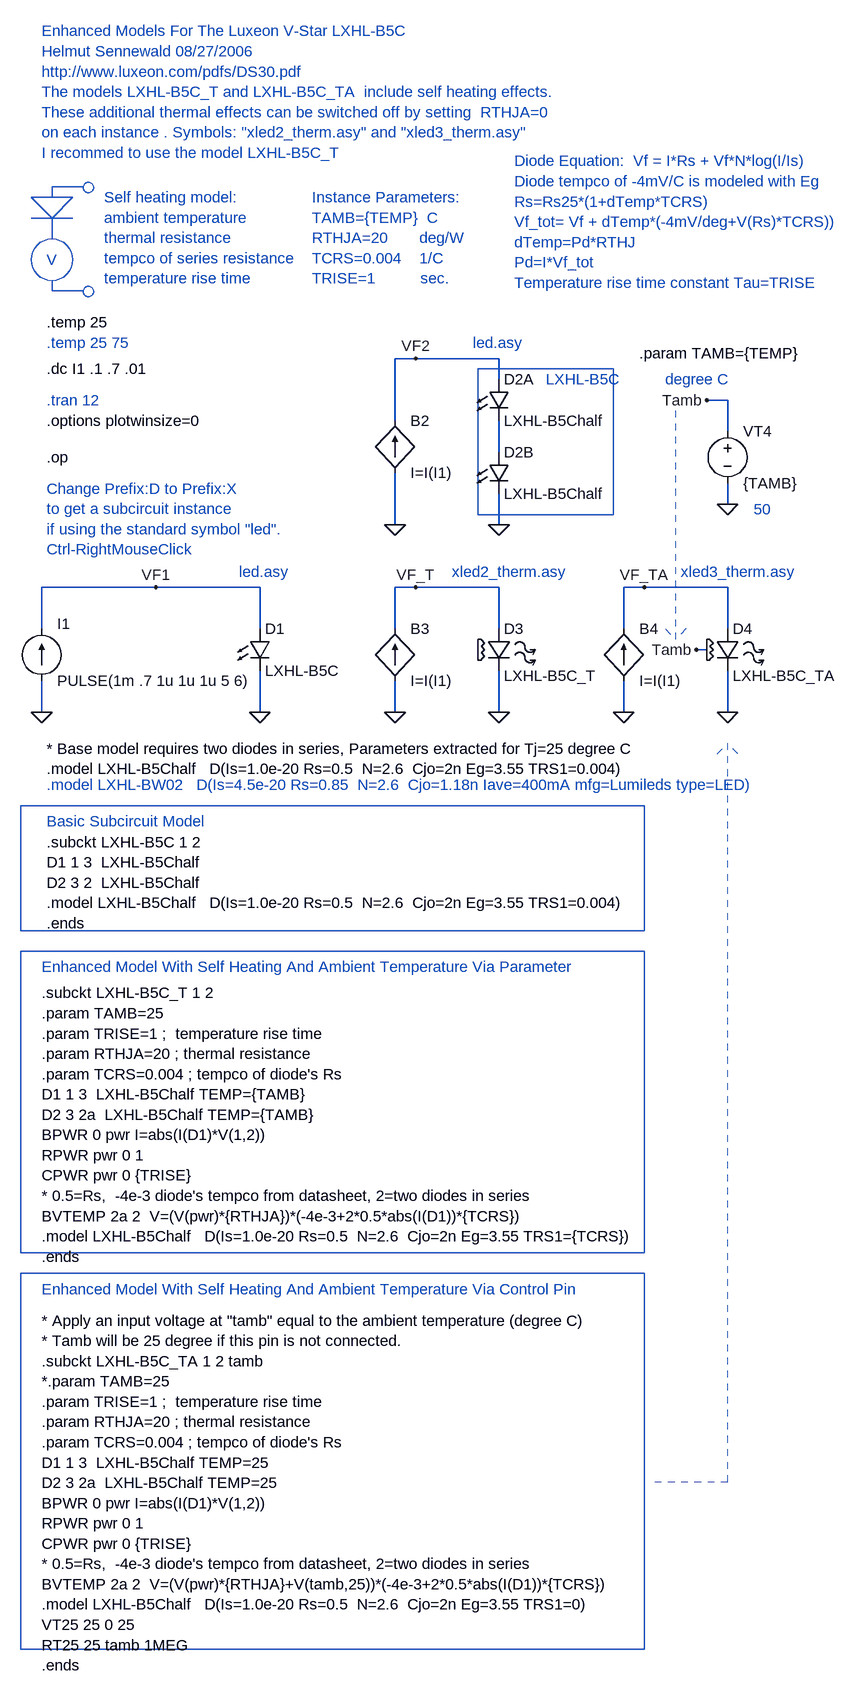
[diagram p0: schematic LXHL-B5C_test.asc]
LXHL-B5C_test.asc, the LTspice schematic file:
Version 4
SHEET 1 1944 1848
WIRE 352 -208 320 -208
WIRE 480 -208 352 -208
WIRE 480 -176 480 -208
WIRE 832 -144 800 -144
WIRE 320 -112 320 -208
WIRE 832 -96 832 -144
WIRE 480 -64 480 -112
WIRE 832 16 832 -16
WIRE 320 48 320 -32
WIRE 480 48 480 0
WIRE -48 144 -224 144
WIRE 112 144 -48 144
WIRE 352 144 320 144
WIRE 480 144 352 144
WIRE 704 144 672 144
WIRE 832 144 704 144
WIRE -224 208 -224 144
WIRE 112 208 112 144
WIRE 320 208 320 144
WIRE 480 208 480 144
WIRE 672 208 672 144
WIRE 832 208 832 144
WIRE 800 240 784 240
WIRE -224 336 -224 288
WIRE 112 336 112 272
WIRE 320 336 320 288
WIRE 480 336 480 272
WIRE 672 336 672 288
WIRE 832 336 832 272
FLAG 480 48 0
FLAG 320 48 0
FLAG 352 -208 VF2
FLAG 112 336 0
FLAG -224 336 0
FLAG -48 144 VF1
FLAG 480 336 0
FLAG 320 336 0
FLAG 352 144 VF_T
FLAG 832 336 0
FLAG 672 336 0
FLAG 704 144 VF_TA
FLAG 832 16 0
FLAG 800 -144 Tamb
FLAG 784 240 Tamb
SYMBOL LED 464 -176 R0
SYMATTR InstName D2A
SYMATTR Value LXHL-B5Chalf
SYMATTR Description Diode
SYMATTR Type diode
SYMBOL LED 464 -64 R0
SYMATTR InstName D2B
SYMATTR Value LXHL-B5Chalf
SYMATTR Description Diode
SYMATTR Type diode
SYMBOL current -224 288 M180
WINDOW 0 24 88 Left 0
WINDOW 3 24 0 Left 0
WINDOW 123 0 0 Left 0
WINDOW 39 0 0 Left 0
SYMATTR InstName I1
SYMATTR Value PULSE(1m .7 1u 1u 1u 5 6)
SYMBOL LED 96 208 R0
SYMATTR InstName D1
SYMATTR Value LXHL-B5C
SYMATTR Prefix X
SYMATTR Description Diode
SYMATTR Type diode
SYMBOL bi2 320 -112 R0
SYMATTR InstName B2
SYMATTR Value I=I(I1)
SYMBOL bi2 320 208 R0
SYMATTR InstName B3
SYMATTR Value I=I(I1)
SYMBOL bi2 672 208 R0
SYMATTR InstName B4
SYMATTR Value I=I(I1)
SYMBOL voltage 832 -112 R0
SYMATTR InstName VT4
SYMATTR Value {TAMB}
SYMBOL xled2_therm 464 208 R0
SYMATTR InstName D3
SYMATTR Value LXHL-B5C_T
SYMBOL xled3_therm 816 208 R0
SYMATTR InstName D4
SYMATTR Value LXHL-B5C_TA
TEXT -216 -56 Left 0 !.op
TEXT -216 -192 Left 0 !.dc I1 .1 .7 .01
TEXT -216 448 Left 0 ;.model LXHL-BW02   D(Is=4.5e-20 Rs=0.85  N=2.6  Cjo=1.18n Iave=400mA mfg=Lumileds type=LED)
TEXT -216 536 Left 0 !.subckt LXHL-B5C 1 2\nD1 1 3  LXHL-B5Chalf\nD2 3 2  LXHL-B5Chalf\n.model LXHL-B5Chalf   D(Is=1.0e-20 Rs=0.5  N=2.6  Cjo=2n Eg=3.55 TRS1=0.004)\n.ends
TEXT -216 -232 Left 0 ;.temp 25 75
TEXT -216 -144 Left 0 ;.tran 12
TEXT -224 768 Left 0 !.subckt LXHL-B5C_T 1 2\n.param TAMB=25\n.param TRISE=1 ;  temperature rise time \n.param RTHJA=20 ; thermal resistance\n.param TCRS=0.004 ; tempco of diode's Rs\nD1 1 3  LXHL-B5Chalf TEMP={TAMB}\nD2 3 2a  LXHL-B5Chalf TEMP={TAMB}\nBPWR 0 pwr I=abs(I(D1)*V(1,2))\nRPWR pwr 0 1\nCPWR pwr 0 {TRISE} \n* 0.5=Rs,  -4e-3 diode's tempco from datasheet, 2=two diodes in series\nBVTEMP 2a 2  V=(V(pwr)*{RTHJA})*(-4e-3+2*0.5*abs(I(D1))*{TCRS})\n.model LXHL-B5Chalf   D(Is=1.0e-20 Rs=0.5  N=2.6  Cjo=2n Eg=3.55 TRS1={TCRS})\n.ends
TEXT -224 728 Left 0 ;Enhanced Model With Self Heating And Ambient Temperature Via Parameter
TEXT -216 504 Left 0 ;Basic Subcircuit Model
TEXT -224 1272 Left 0 !* Apply an input voltage at "tamb" equal to the ambient temperature (degree C)\n* Tamb will be 25 degree if this pin is not connected. \n.subckt LXHL-B5C_TA 1 2 tamb\n*.param TAMB=25\n.param TRISE=1 ;  temperature rise time \n.param RTHJA=20 ; thermal resistance\n.param TCRS=0.004 ; tempco of diode's Rs\nD1 1 3  LXHL-B5Chalf TEMP=25\nD2 3 2a  LXHL-B5Chalf TEMP=25\nBPWR 0 pwr I=abs(I(D1)*V(1,2))\nRPWR pwr 0 1\nCPWR pwr 0 {TRISE} \n* 0.5=Rs,  -4e-3 diode's tempco from datasheet, 2=two diodes in series\nBVTEMP 2a 2  V=(V(pwr)*{RTHJA}+V(tamb,25))*(-4e-3+2*0.5*abs(I(D1))*{TCRS})\n.model LXHL-B5Chalf   D(Is=1.0e-20 Rs=0.5  N=2.6  Cjo=2n Eg=3.55 TRS1=0)\nVT25 25 0 25\nRT25 25 tamb 1MEG \n.ends
TEXT -224 1224 Left 0 ;Enhanced Model With Self Heating And Ambient Temperature Via Control Pin
TEXT -216 392 Left 0 !* Base model requires two diodes in series, Parameters extracted for Tj=25 degree C\n.model LXHL-B5Chalf   D(Is=1.0e-20 Rs=0.5  N=2.6  Cjo=2n Eg=3.55 TRS1=0.004)
TEXT -224 -712 Left 0 ;Enhanced Models For The Luxeon V-Star LXHL-B5C\nHelmut Sennewald 08/27/2006\nhttp://www.luxeon.com/pdfs/DS30.pdf\nThe models LXHL-B5C_T and LXHL-B5C_TA  include self heating effects.\nThese additional thermal effects can be switched off by setting  RTHJA=0 \non each instance . Symbols: "xled2_therm.asy" and "xled3_therm.asy"\nI recommed to use the model LXHL-B5C_T
TEXT -216 -112 Left 0 !.options plotwinsize=0
TEXT -216 -8 Left 0 ;Change Prefix:D to Prefix:X\nto get a subcircuit instance\nif using the standard symbol "led".\nCtrl-RightMouseClick
TEXT 736 -176 Left 0 ;degree C
TEXT 552 -176 Left 0 ;LXHL-B5C
TEXT 760 120 Left 0 ;xled3_therm.asy
TEXT 408 120 Left 0 ;xled2_therm.asy
TEXT 80 120 Left 0 ;led.asy
TEXT 440 -232 Left 0 ;led.asy
TEXT 872 24 Left 0 ;50
TEXT 696 -216 Left 0 !.param TAMB={TEMP}
TEXT -216 -264 Left 0 !.temp 25
TEXT -128 -456 Left 0 ;Self heating model:\nambient temperature \nthermal resistance     \ntempco of series resistance   \ntemperature rise time
TEXT -216 -360 Left 0 ;V
TEXT 192 -456 Left 0 ;Instance Parameters:\nTAMB={TEMP}  C\nRTHJA=20       deg/W\nTCRS=0.004    1/C\nTRISE=1          sec.
TEXT 504 -512 Left 0 ;Diode Equation:  Vf = I*Rs + Vf*N*log(I/Is)\nDiode tempco of -4mV/C is modeled with Eg\nRs=Rs25*(1+dTemp*TCRS)\nVf_tot= Vf + dTemp*(-4mV/deg+V(Rs)*TCRS))\ndTemp=Pd*RTHJ\nPd=I*Vf_tot\nTemperature rise time constant Tau=TRISE
LINE Normal 752 224 752 -128 2
LINE Normal 768 208 752 224 2
LINE Normal 736 208 752 224 2
LINE Normal -176 -456 -240 -456
LINE Normal -208 -424 -176 -456
LINE Normal -240 -456 -208 -424
LINE Normal -176 -424 -240 -424
LINE Normal -208 -392 -208 -424
LINE Normal -208 -312 -208 -328
LINE Normal -160 -312 -208 -312
LINE Normal -208 -472 -208 -456
LINE Normal -160 -472 -208 -472
LINE Normal 832 1520 832 384 2
LINE Normal 720 1520 832 1520 2
LINE Normal 848 400 832 384 2
LINE Normal 816 400 832 384 2
RECTANGLE Normal 704 672 -256 480
RECTANGLE Normal 704 1168 -256 704
RECTANGLE Normal 704 1778 -256 1199
RECTANGLE Normal 656 32 448 -192
CIRCLE Normal -176 -328 -240 -392
CIRCLE Normal -144 -463 -160 -479
CIRCLE Normal -144 -303 -160 -319

The netlist it stands for:
* LXHL-B5C_test.asc
D2A VF2 N001 LXHL-B5Chalf
D2B N001 0 LXHL-B5Chalf
I1 0 VF1 PULSE(1m .7 1u 1u 1u 5 6)
XD1 VF1 0 LXHL-B5C  ; pins + -
B2 0 VF2 I=I(I1)
B3 0 VF_T I=I(I1)
B4 0 VF_TA I=I(I1)
VT4 Tamb 0 {TAMB}
XD3 VF_T 0 LXHL-B5C_T RTHJA=20  TRISE=1 TCRS=0.004 TAMB={TEMP}  ; pins + -
XD4 VF_TA 0 Tamb LXHL-B5C_TA RTHJA=20  TRISE=1 TCRS=0.004  ; pins + - TAMB
.model D D
.lib standard.dio
.op
.dc I1 .1 .7 .01
* .model LXHL-BW02   D(Is=4.5e-20 Rs=0.85  N=2.6  Cjo=1.18n Iave=400mA mfg=Lumileds type=LED)
.subckt LXHL-B5C 1 2
D1 1 3  LXHL-B5Chalf
D2 3 2  LXHL-B5Chalf
.model LXHL-B5Chalf   D(Is=1.0e-20 Rs=0.5  N=2.6  Cjo=2n Eg=3.55 TRS1=0.004)
.ends
* .temp 25 75
* .tran 12
.subckt LXHL-B5C_T 1 2
.param TAMB=25
.param TRISE=1 ;  temperature rise time
.param RTHJA=20 ; thermal resistance
.param TCRS=0.004 ; tempco of diode's Rs
D1 1 3  LXHL-B5Chalf TEMP={TAMB}
D2 3 2a  LXHL-B5Chalf TEMP={TAMB}
BPWR 0 pwr I=abs(I(D1)*V(1,2))
RPWR pwr 0 1
CPWR pwr 0 {TRISE}
* 0.5=Rs,  -4e-3 diode's tempco from datasheet, 2=two diodes in series
BVTEMP 2a 2  V=(V(pwr)*{RTHJA})*(-4e-3+2*0.5*abs(I(D1))*{TCRS})
.model LXHL-B5Chalf   D(Is=1.0e-20 Rs=0.5  N=2.6  Cjo=2n Eg=3.55 TRS1={TCRS})
.ends
* Enhanced Model With Self Heating And Ambient Temperature Via Parameter
* Basic Subcircuit Model
* Apply an input voltage at "tamb" equal to the ambient temperature (degree C)
* Tamb will be 25 degree if this pin is not connected.
.subckt LXHL-B5C_TA 1 2 tamb
*.param TAMB=25
.param TRISE=1 ;  temperature rise time
.param RTHJA=20 ; thermal resistance
.param TCRS=0.004 ; tempco of diode's Rs
D1 1 3  LXHL-B5Chalf TEMP=25
D2 3 2a  LXHL-B5Chalf TEMP=25
BPWR 0 pwr I=abs(I(D1)*V(1,2))
RPWR pwr 0 1
CPWR pwr 0 {TRISE}
* 0.5=Rs,  -4e-3 diode's tempco from datasheet, 2=two diodes in series
BVTEMP 2a 2  V=(V(pwr)*{RTHJA}+V(tamb,25))*(-4e-3+2*0.5*abs(I(D1))*{TCRS})
.model LXHL-B5Chalf   D(Is=1.0e-20 Rs=0.5  N=2.6  Cjo=2n Eg=3.55 TRS1=0)
VT25 25 0 25
RT25 25 tamb 1MEG
.ends
* Enhanced Model With Self Heating And Ambient Temperature Via Control Pin
* Base model requires two diodes in series, Parameters extracted for Tj=25 degree C
.model LXHL-B5Chalf   D(Is=1.0e-20 Rs=0.5  N=2.6  Cjo=2n Eg=3.55 TRS1=0.004)
* Enhanced Models For The Luxeon V-Star LXHL-B5C
* Helmut Sennewald 08/27/2006
* http://www.luxeon.com/pdfs/DS30.pdf
* The models LXHL-B5C_T and LXHL-B5C_TA  include self heating effects.
* These additional thermal effects can be switched off by setting  RTHJA=0
* on each instance . Symbols: "xled2_therm.asy" and "xled3_therm.asy"
* I recommed to use the model LXHL-B5C_T
.options plotwinsize=0
* Change Prefix:D to Prefix:X
* to get a subcircuit instance
* if using the standard symbol "led".
* Ctrl-RightMouseClick
* degree C
* LXHL-B5C
* xled3_therm.asy
* xled2_therm.asy
* led.asy
* led.asy
* 50
.param TAMB={TEMP}
.temp 25
* Self heating model:
* ambient temperature
* thermal resistance
* tempco of series resistance
* temperature rise time
* V
* Instance Parameters:
* TAMB={TEMP}  C
* RTHJA=20       deg/W
* TCRS=0.004    1/C
* TRISE=1          sec.
* Diode Equation:  Vf = I*Rs + Vf*N*log(I/Is)
* Diode tempco of -4mV/C is modeled with Eg
* Rs=Rs25*(1+dTemp*TCRS)
* Vf_tot= Vf + dTemp*(-4mV/deg+V(Rs)*TCRS))
* dTemp=Pd*RTHJ
* Pd=I*Vf_tot
* Temperature rise time constant Tau=TRISE
.backanno
.end